# Altium schematic sheet coremodule.schdoc: Core Module
size 431 x 279 mm; DrawnBy: D. Bruey, M. Ciuffo; Organization: Synapse Product Development, LLC.; Address1: 1511 6th Ave., Suite 400; Address2: Seattle, Washington 98101; Address3: 206.381.0898; Address4: www.synapse.com; SheetNumber: 2; SheetTotal: 7; PageSetup: Record=PageOptions|CenterHorizontal=True|CenterVertical=True|PrintScale=1.06|XCorrection=1.00|YCorrection=1.00|PrintKind=1|BorderSize=5000000|LeftOffset=0|BottomOffset=0|Orientation=2|PaperLength=4318|PaperWidth=2794|Scale=100|PaperSource=7|PrintQuality=200|MediaType=1|DitherType=10|PrintScaleMode=1|PaperKind=11x17|PaperIndex=3
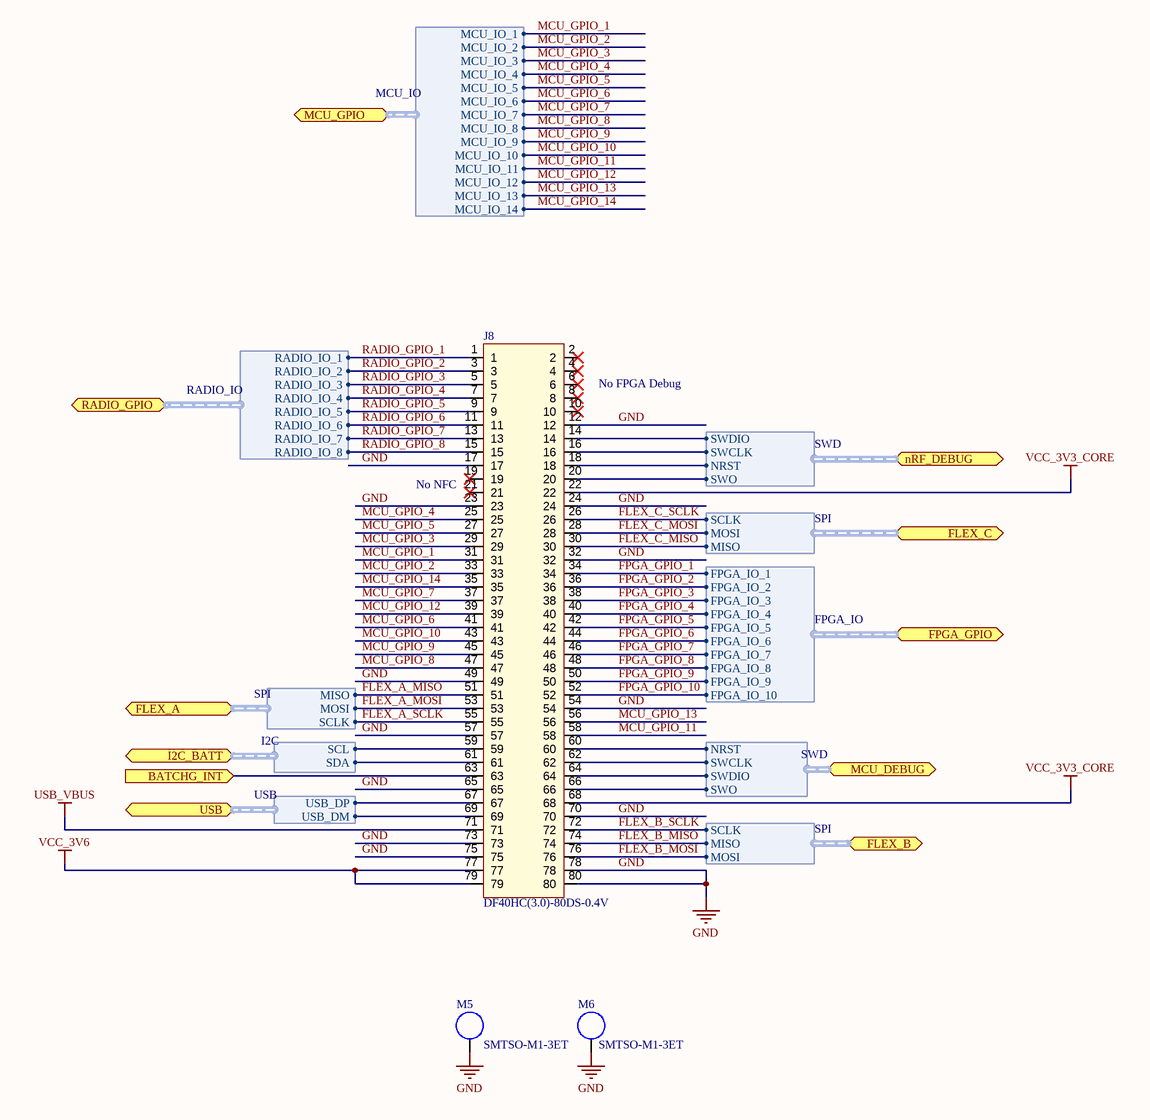
[diagram p0: coremodule.schdoc]

## Parts
J8  DF40HC(3.0)-80DS-0.4V  [con80_hirose-df40c-80ds_129h]
M5  SMTSO-M1-3ET  [standoff_hole2p50p]
M6  SMTSO-M1-3ET  [standoff_hole2p50p]

## Ports
BATCHG_INT (in), FLEX_A (harness SPI), FLEX_B (harness SPI), FLEX_C (harness SPI), FPGA_GPIO (harness FPGA_IO), I2C_BATT (harness I2C), MCU_DEBUG (harness SWD), MCU_GPIO (harness MCU_IO), nRF_DEBUG (harness SWD), RADIO_GPIO (harness RADIO_IO), USB (harness USB)

## Harnesses
SPI: MOSI, MISO, SCLK
USB: USB_DM, USB_DP
I2C: SDA, SCL
SWD: NRST, SWCLK, SWDIO, SWO
MCU_IO: MCU_IO_1, MCU_IO_2, MCU_IO_3, MCU_IO_4, MCU_IO_5, MCU_IO_6, MCU_IO_7, MCU_IO_8, MCU_IO_9, MCU_IO_10, MCU_IO_11, MCU_IO_12, MCU_IO_13, MCU_IO_14
FPGA_IO: FPGA_IO_2, FPGA_IO_3, FPGA_IO_4, FPGA_IO_5, FPGA_IO_6, FPGA_IO_7, FPGA_IO_8, FPGA_IO_9, FPGA_IO_10, FPGA_IO_1
RADIO_IO: RADIO_IO_1, RADIO_IO_2, RADIO_IO_3, RADIO_IO_4, RADIO_IO_5, RADIO_IO_6, RADIO_IO_7, RADIO_IO_8

## Nets
GND: J8.12 J8.17 J8.23 J8.24 J8.32 J8.49 J8.54 J8.57 J8.65 J8.70 J8.73 J8.75 J8.78 J8.80 M5.1 M6.1
USB_VBUS: J8.71
VCC_3V3_CORE: J8.22 J8.68
VCC_3V6: J8.77 J8.79
BATCHG_INT: J8.63 ; port BATCHG_INT
FLEX_A_MISO: J8.51 ; port FLEX_A.MISO
FLEX_A_MOSI: J8.53 ; port FLEX_A.MOSI
FLEX_A_SCLK: J8.55 ; port FLEX_A.SCLK
FLEX_B_MISO: J8.74 ; port FLEX_B.MISO
FLEX_B_MOSI: J8.76 ; port FLEX_B.MOSI
FLEX_B_SCLK: J8.72 ; port FLEX_B.SCLK
FLEX_C_MISO: J8.30 ; port FLEX_C.MISO
FLEX_C_MOSI: J8.28 ; port FLEX_C.MOSI
FLEX_C_SCLK: J8.26 ; port FLEX_C.SCLK
FPGA_GPIO_1: J8.34 ; port FPGA_GPIO.FPGA_IO_1
FPGA_GPIO_2: J8.36 ; port FPGA_GPIO.FPGA_IO_2
FPGA_GPIO_3: J8.38 ; port FPGA_GPIO.FPGA_IO_3
FPGA_GPIO_4: J8.40 ; port FPGA_GPIO.FPGA_IO_4
FPGA_GPIO_5: J8.42 ; port FPGA_GPIO.FPGA_IO_5
FPGA_GPIO_6: J8.44 ; port FPGA_GPIO.FPGA_IO_6
FPGA_GPIO_7: J8.46 ; port FPGA_GPIO.FPGA_IO_7
FPGA_GPIO_8: J8.48 ; port FPGA_GPIO.FPGA_IO_8
FPGA_GPIO_9: J8.50 ; port FPGA_GPIO.FPGA_IO_9
FPGA_GPIO_10: J8.52 ; port FPGA_GPIO.FPGA_IO_10
MCU_GPIO_1: J8.31 ; port MCU_GPIO.MCU_IO_1
MCU_GPIO_2: J8.33 ; port MCU_GPIO.MCU_IO_2
MCU_GPIO_3: J8.29 ; port MCU_GPIO.MCU_IO_3
MCU_GPIO_4: J8.25 ; port MCU_GPIO.MCU_IO_4
MCU_GPIO_5: J8.27 ; port MCU_GPIO.MCU_IO_5
MCU_GPIO_6: J8.41 ; port MCU_GPIO.MCU_IO_6
MCU_GPIO_7: J8.37 ; port MCU_GPIO.MCU_IO_7
MCU_GPIO_8: J8.47 ; port MCU_GPIO.MCU_IO_8
MCU_GPIO_9: J8.45 ; port MCU_GPIO.MCU_IO_9
MCU_GPIO_10: J8.43 ; port MCU_GPIO.MCU_IO_10
MCU_GPIO_11: J8.58 ; port MCU_GPIO.MCU_IO_11
MCU_GPIO_12: J8.39 ; port MCU_GPIO.MCU_IO_12
MCU_GPIO_13: J8.56 ; port MCU_GPIO.MCU_IO_13
MCU_GPIO_14: J8.35 ; port MCU_GPIO.MCU_IO_14
RADIO_GPIO_1: J8.1 ; port RADIO_GPIO.RADIO_IO_1
RADIO_GPIO_2: J8.3 ; port RADIO_GPIO.RADIO_IO_2
RADIO_GPIO_3: J8.5 ; port RADIO_GPIO.RADIO_IO_3
RADIO_GPIO_4: J8.7 ; port RADIO_GPIO.RADIO_IO_4
RADIO_GPIO_5: J8.9 ; port RADIO_GPIO.RADIO_IO_5
RADIO_GPIO_6: J8.11 ; port RADIO_GPIO.RADIO_IO_6
RADIO_GPIO_7: J8.13 ; port RADIO_GPIO.RADIO_IO_7
RADIO_GPIO_8: J8.15 ; port RADIO_GPIO.RADIO_IO_8
NetJ8_14: J8.14 ; port nRF_DEBUG.SWDIO
NetJ8_16: J8.16 ; port nRF_DEBUG.SWCLK
NetJ8_18: J8.18 ; port nRF_DEBUG.NRST
NetJ8_20: J8.20 ; port nRF_DEBUG.SWO
NetJ8_59: J8.59 ; port I2C_BATT.SCL
NetJ8_60: J8.60 ; port MCU_DEBUG.NRST
NetJ8_61: J8.61 ; port I2C_BATT.SDA
NetJ8_62: J8.62 ; port MCU_DEBUG.SWCLK
NetJ8_64: J8.64 ; port MCU_DEBUG.SWDIO
NetJ8_66: J8.66 ; port MCU_DEBUG.SWO
NetJ8_67: J8.67 ; port USB.USB_DP
NetJ8_69: J8.69 ; port USB.USB_DM

Not connected (* = marked no-connect by the designer): J8 2* 4* 6* 8* 10* 19* 21*

## Notes on the sheet
- (near J8) No FPGA Debug
- (near J8) No NFC
- Design Notes:
- Layout Notes:
- Project:
- Sheet Title:
- PCBA:
- PROPRIETARY AND CONFIDENTIAL
- Drawn by:
- Schematic Part Number:
- Schematic Revision:
- Date:
- Sheet:
- /

## Library data of the parts
J8 = DF40HC(3.0)-80DS-0.4V(51): CONN RCPT 80POS 0.4MM SMD GOLD 3.0MM; part_type: connector; id: 1591; mfg: Hirose; dist: Mouser; dist_pn: 798-DF40HC3080D04V51; source_package: DF40C-80DS-0.4V(51); voltage: 30V; positions: 80; TableName: viewAltiumConnectors; mfg_pn: DF40HC(3.0)-80DS-0.4V(51); height: 3.0mm; status: Unknown; datasheet: http://www.hirose.co.jp/cataloge_hp/ed_DF40_20140305.pdf
M5 M6 = SMTSO-M1-3ET: SMT mounted PEM Standoff, M1, length 3mm; part_type: mounting; id: 1166; mfg: Penn Engineering; dist: Hi-Tech Fasteners; TableName: viewAltiumMisc; mfg_pn: SMTSO-M1-3ET; dist_pn: SMTSO-M1-3ET; status: Unknown